# Altium schematic sheet panel3.SchDoc
size A
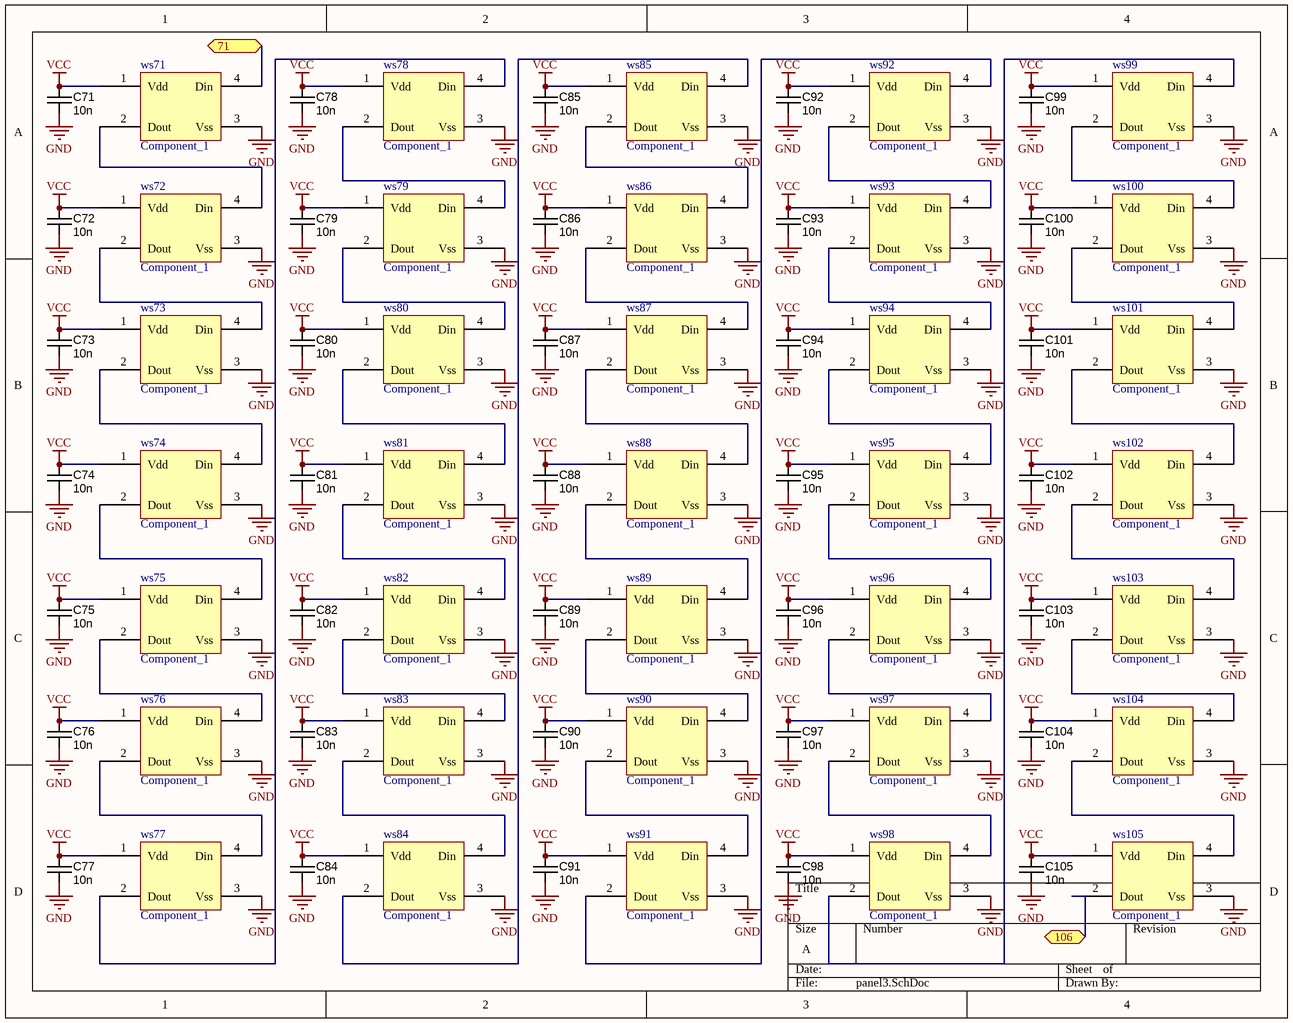
[diagram p0: panel3.SchDoc]

## Parts
C71  value 10n  [CAPC1608X90N]  (hidden comment: approved sub OK)
C72  value 10n  [CAPC1608X90N]  (hidden comment: approved sub OK)
C73  value 10n  [CAPC1608X90N]  (hidden comment: approved sub OK)
C74  value 10n  [CAPC1608X90N]  (hidden comment: approved sub OK)
C75  value 10n  [CAPC1608X90N]  (hidden comment: approved sub OK)
C76  value 10n  [CAPC1608X90N]  (hidden comment: approved sub OK)
C77  value 10n  [CAPC1608X90N]  (hidden comment: approved sub OK)
C78  value 10n  [CAPC1608X90N]  (hidden comment: approved sub OK)
C79  value 10n  [CAPC1608X90N]  (hidden comment: approved sub OK)
C80  value 10n  [CAPC1608X90N]  (hidden comment: approved sub OK)
C81  value 10n  [CAPC1608X90N]  (hidden comment: approved sub OK)
C82  value 10n  [CAPC1608X90N]  (hidden comment: approved sub OK)
C83  value 10n  [CAPC1608X90N]  (hidden comment: approved sub OK)
C84  value 10n  [CAPC1608X90N]  (hidden comment: approved sub OK)
C85  value 10n  [CAPC1608X90N]  (hidden comment: approved sub OK)
C86  value 10n  [CAPC1608X90N]  (hidden comment: approved sub OK)
C87  value 10n  [CAPC1608X90N]  (hidden comment: approved sub OK)
C88  value 10n  [CAPC1608X90N]  (hidden comment: approved sub OK)
C89  value 10n  [CAPC1608X90N]  (hidden comment: approved sub OK)
C90  value 10n  [CAPC1608X90N]  (hidden comment: approved sub OK)
C91  value 10n  [CAPC1608X90N]  (hidden comment: approved sub OK)
C92  value 10n  [CAPC1608X90N]  (hidden comment: approved sub OK)
C93  value 10n  [CAPC1608X90N]  (hidden comment: approved sub OK)
C94  value 10n  [CAPC1608X90N]  (hidden comment: approved sub OK)
C95  value 10n  [CAPC1608X90N]  (hidden comment: approved sub OK)
C96  value 10n  [CAPC1608X90N]  (hidden comment: approved sub OK)
C97  value 10n  [CAPC1608X90N]  (hidden comment: approved sub OK)
C98  value 10n  [CAPC1608X90N]  (hidden comment: approved sub OK)
C99  value 10n  [CAPC1608X90N]  (hidden comment: approved sub OK)
C100  value 10n  [CAPC1608X90N]  (hidden comment: approved sub OK)
C101  value 10n  [CAPC1608X90N]  (hidden comment: approved sub OK)
C102  value 10n  [CAPC1608X90N]  (hidden comment: approved sub OK)
C103  value 10n  [CAPC1608X90N]  (hidden comment: approved sub OK)
C104  value 10n  [CAPC1608X90N]  (hidden comment: approved sub OK)
C105  value 10n  [CAPC1608X90N]  (hidden comment: approved sub OK)
ws71  Component_1  [SOP4]
ws72  Component_1  [SOP4]
ws73  Component_1  [SOP4]
ws74  Component_1  [SOP4]
ws75  Component_1  [SOP4]
ws76  Component_1  [SOP4]
ws77  Component_1  [SOP4]
ws78  Component_1  [SOP4]
ws79  Component_1  [SOP4]
ws80  Component_1  [SOP4]
ws81  Component_1  [SOP4]
ws82  Component_1  [SOP4]
ws83  Component_1  [SOP4]
ws84  Component_1  [SOP4]
ws85  Component_1  [SOP4]
ws86  Component_1  [SOP4]
ws87  Component_1  [SOP4]
ws88  Component_1  [SOP4]
ws89  Component_1  [SOP4]
ws90  Component_1  [SOP4]
ws91  Component_1  [SOP4]
ws92  Component_1  [SOP4]
ws93  Component_1  [SOP4]
ws94  Component_1  [SOP4]
ws95  Component_1  [SOP4]
ws96  Component_1  [SOP4]
ws97  Component_1  [SOP4]
ws98  Component_1  [SOP4]
ws99  Component_1  [SOP4]
ws100  Component_1  [SOP4]
ws101  Component_1  [SOP4]
ws102  Component_1  [SOP4]
ws103  Component_1  [SOP4]
ws104  Component_1  [SOP4]
ws105  Component_1  [SOP4]

## Ports
71, 106

## Nets
GND: C71.2 C72.2 C73.2 C74.2 C75.2 C76.2 C77.2 C78.2 C79.2 C80.2 C81.2 C82.2 C83.2 C84.2 C85.2 C86.2 C87.2 C88.2 C89.2 C90.2 C91.2 C92.2 C93.2 C94.2 C95.2 C96.2 C97.2 C98.2 C99.2 C100.2 C101.2 C102.2 C103.2 C104.2 C105.2 ws71.3(Vss) ws72.3(Vss) ws73.3(Vss) ws74.3(Vss) ws75.3(Vss) ws76.3(Vss) ws77.3(Vss) ws78.3(Vss) ws79.3(Vss) ws80.3(Vss) ws81.3(Vss) ws82.3(Vss) ws83.3(Vss) ws84.3(Vss) ws85.3(Vss) ws86.3(Vss) ws87.3(Vss) ws88.3(Vss) ws89.3(Vss) ws90.3(Vss) ws91.3(Vss) ws92.3(Vss) ws93.3(Vss) ws94.3(Vss) ws95.3(Vss) ws96.3(Vss) ws97.3(Vss) ws98.3(Vss) ws99.3(Vss) ws100.3(Vss) ws101.3(Vss) ws102.3(Vss) ws103.3(Vss) ws104.3(Vss) ws105.3(Vss)
VCC: C71.1 C72.1 C73.1 C74.1 C75.1 C76.1 C77.1 C78.1 C79.1 C80.1 C81.1 C82.1 C83.1 C84.1 C85.1 C86.1 C87.1 C88.1 C89.1 C90.1 C91.1 C92.1 C93.1 C94.1 C95.1 C96.1 C97.1 C98.1 C99.1 C100.1 C101.1 C102.1 C103.1 C104.1 C105.1 ws71.1(Vdd) ws72.1(Vdd) ws73.1(Vdd) ws74.1(Vdd) ws75.1(Vdd) ws76.1(Vdd) ws77.1(Vdd) ws78.1(Vdd) ws79.1(Vdd) ws80.1(Vdd) ws81.1(Vdd) ws82.1(Vdd) ws83.1(Vdd) ws84.1(Vdd) ws85.1(Vdd) ws86.1(Vdd) ws87.1(Vdd) ws88.1(Vdd) ws89.1(Vdd) ws90.1(Vdd) ws91.1(Vdd) ws92.1(Vdd) ws93.1(Vdd) ws94.1(Vdd) ws95.1(Vdd) ws96.1(Vdd) ws97.1(Vdd) ws98.1(Vdd) ws99.1(Vdd) ws100.1(Vdd) ws101.1(Vdd) ws102.1(Vdd) ws103.1(Vdd) ws104.1(Vdd) ws105.1(Vdd)
71: ws71.4(Din) ; port 71
106: ws105.2(Dout) ; port 106
Netws71_2: ws71.2(Dout) ws72.4(Din)
Netws72_2: ws72.2(Dout) ws73.4(Din)
Netws73_2: ws73.2(Dout) ws74.4(Din)
Netws74_2: ws74.2(Dout) ws75.4(Din)
Netws75_2: ws75.2(Dout) ws76.4(Din)
Netws76_2: ws76.2(Dout) ws77.4(Din)
Netws77_2: ws77.2(Dout) ws78.4(Din)
Netws78_2: ws78.2(Dout) ws79.4(Din)
Netws79_2: ws79.2(Dout) ws80.4(Din)
Netws80_2: ws80.2(Dout) ws81.4(Din)
Netws81_2: ws81.2(Dout) ws82.4(Din)
Netws82_2: ws82.2(Dout) ws83.4(Din)
Netws83_2: ws83.2(Dout) ws84.4(Din)
Netws84_2: ws84.2(Dout) ws85.4(Din)
Netws85_2: ws85.2(Dout) ws86.4(Din)
Netws86_2: ws86.2(Dout) ws87.4(Din)
Netws87_2: ws87.2(Dout) ws88.4(Din)
Netws88_2: ws88.2(Dout) ws89.4(Din)
Netws89_2: ws89.2(Dout) ws90.4(Din)
Netws90_2: ws90.2(Dout) ws91.4(Din)
Netws91_2: ws91.2(Dout) ws92.4(Din)
Netws92_2: ws92.2(Dout) ws93.4(Din)
Netws93_2: ws93.2(Dout) ws94.4(Din)
Netws94_2: ws94.2(Dout) ws95.4(Din)
Netws95_2: ws95.2(Dout) ws96.4(Din)
Netws96_2: ws96.2(Dout) ws97.4(Din)
Netws97_2: ws97.2(Dout) ws98.4(Din)
Netws98_2: ws98.2(Dout) ws99.4(Din)
Netws99_2: ws99.2(Dout) ws100.4(Din)
Netws100_2: ws100.2(Dout) ws101.4(Din)
Netws101_2: ws101.2(Dout) ws102.4(Din)
Netws102_2: ws102.2(Dout) ws103.4(Din)
Netws103_2: ws103.2(Dout) ws104.4(Din)
Netws104_2: ws104.2(Dout) ws105.4(Din)

## Library data of the parts
C71-C105 = CAPC_10n_0603_X7R_100V_10%: Capacitor SMD Cer 10nF 10% 100V X7R 0603; Manufacturer: Murata Electronics North America; Manufacturer Part Number: GCM188R72A103KA37D; Ratings: 100V; X7R; Material: ceramic; SCDType: undef; Package / Case: 0603 (1608 metric); Tolerance: ±10%; Supplier 1: Digi-Key; Supplier Part Number 1: 490-4781-1-ND